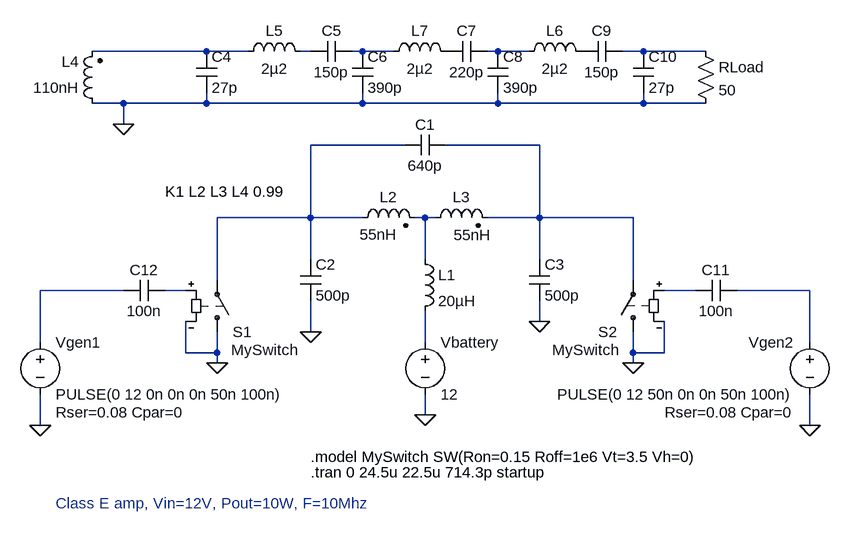
[diagram p0: schematic classe-pushpull-10Mhz-tuned-bpf.asc]
classe-pushpull-10Mhz-tuned-bpf.asc, the LTspice schematic file:
Version 4
SHEET 1 1364 344
WIRE 256 -368 80 -368
WIRE 320 -368 256 -368
WIRE 416 -368 400 -368
WIRE 496 -368 480 -368
WIRE 544 -368 496 -368
WIRE 704 -368 688 -368
WIRE 752 -368 704 -368
WIRE 928 -368 896 -368
WIRE 1024 -368 928 -368
WIRE 128 -288 80 -288
WIRE 256 -288 256 -304
WIRE 256 -288 128 -288
WIRE 496 -288 496 -304
WIRE 496 -288 256 -288
WIRE 704 -288 704 -304
WIRE 704 -288 496 -288
WIRE 928 -288 928 -304
WIRE 928 -288 704 -288
WIRE 1024 -288 928 -288
WIRE 128 -256 128 -288
WIRE 560 -224 416 -224
WIRE 768 -224 624 -224
WIRE 416 -112 416 -224
WIRE 416 -112 272 -112
WIRE 496 -112 416 -112
WIRE 592 -112 576 -112
WIRE 608 -112 592 -112
WIRE 768 -112 768 -224
WIRE 768 -112 688 -112
WIRE 912 -112 768 -112
WIRE 416 -48 416 -112
WIRE 592 -48 592 -112
WIRE 768 -48 768 -112
WIRE 272 -16 272 -112
WIRE 912 -16 912 -112
WIRE 128 0 0 0
WIRE 224 0 192 0
WIRE 1008 0 960 0
WIRE 1184 0 1072 0
WIRE 768 48 768 16
WIRE 416 64 416 16
WIRE 0 80 0 0
WIRE 592 80 592 32
WIRE 1184 80 1184 0
WIRE 224 96 224 48
WIRE 272 96 272 64
WIRE 272 96 224 96
WIRE 912 96 912 64
WIRE 960 96 960 48
WIRE 960 96 912 96
WIRE 272 112 272 96
WIRE 912 112 912 96
WIRE 592 192 592 160
WIRE 0 208 0 160
WIRE 1184 208 1184 160
FLAG 0 208 0
FLAG 272 112 0
FLAG 592 192 0
FLAG 416 64 0
FLAG 1184 208 0
FLAG 912 112 0
FLAG 768 48 0
FLAG 128 -256 0
SYMBOL voltage 592 64 R0
WINDOW 123 24 132 Left 2
WINDOW 39 0 0 Left 2
SYMATTR Value2 ""
SYMATTR SpiceLine ""
SYMATTR InstName Vbattery
SYMATTR Value 12
SYMBOL voltage 0 64 R0
WINDOW 123 24 132 Left 2
WINDOW 39 24 124 Left 2
SYMATTR Value2 ""
SYMATTR SpiceLine Rser=0.08 Cpar=0
SYMATTR InstName Vgen1
SYMATTR Value PULSE(0 12 0n 0n 0n 50n 100n)
SYMBOL ind 576 -64 R0
SYMATTR InstName L1
SYMATTR Value 20µH
SYMATTR SpiceLine Rser=0.5
SYMBOL cap 400 -48 R0
SYMATTR InstName C2
SYMATTR Value 500p
SYMATTR SpiceLine Rser=25m
SYMBOL cap 624 -240 R90
WINDOW 0 0 32 VBottom 2
WINDOW 3 32 32 VTop 2
SYMATTR InstName C1
SYMATTR Value 640p
SYMATTR SpiceLine Rser=0.015
SYMBOL ind2 480 -96 R270
WINDOW 0 32 56 VTop 2
WINDOW 3 6 40 VBottom 2
SYMATTR InstName L2
SYMATTR Value 55nH
SYMATTR Type ind
SYMATTR SpiceLine Rser=0.045
SYMBOL res 1008 -384 R0
SYMATTR InstName RLoad
SYMATTR Value 50
SYMBOL sw 272 80 M180
WINDOW 3 22 -12 Left 2
SYMATTR Value MySwitch
SYMATTR InstName S1
SYMBOL voltage 1184 64 M0
WINDOW 123 24 132 Left 2
WINDOW 39 24 124 Left 2
SYMATTR Value2 ""
SYMATTR SpiceLine Rser=0.08 Cpar=0
SYMATTR InstName Vgen2
SYMATTR Value PULSE(0 12 50n 0n 0n 50n 100n)
SYMBOL sw 912 80 R180
WINDOW 3 22 -12 Left 2
SYMATTR Value MySwitch
SYMATTR InstName S2
SYMBOL ind2 592 -96 R270
WINDOW 0 32 56 VTop 2
WINDOW 3 5 73 VBottom 2
SYMATTR InstName L3
SYMATTR Value 55nH
SYMATTR Type ind
SYMATTR SpiceLine Rser=0.045
SYMBOL cap 752 -48 R0
SYMATTR InstName C3
SYMATTR Value 500p
SYMATTR SpiceLine Rser=25m
SYMBOL ind2 96 -272 R180
WINDOW 0 36 80 Left 2
WINDOW 3 36 40 Left 2
SYMATTR InstName L4
SYMATTR Value 110nH
SYMATTR Type ind
SYMATTR SpiceLine Rser=0.05
SYMBOL cap 240 -368 R0
SYMATTR InstName C4
SYMATTR Value 27p
SYMATTR SpiceLine Rser=15m
SYMBOL ind 304 -352 R270
WINDOW 0 32 56 VTop 2
WINDOW 3 5 56 VBottom 2
SYMATTR InstName L5
SYMATTR Value 2µ2
SYMBOL cap 480 -384 R90
WINDOW 0 0 32 VBottom 2
WINDOW 3 32 32 VTop 2
SYMATTR InstName C5
SYMATTR Value 150p
SYMATTR SpiceLine Rser=15m
SYMBOL cap 480 -368 R0
SYMATTR InstName C6
SYMATTR Value 390p
SYMATTR SpiceLine Rser=15m
SYMBOL cap 688 -384 R90
WINDOW 0 0 32 VBottom 2
WINDOW 3 32 32 VTop 2
SYMATTR InstName C7
SYMATTR Value 220p
SYMATTR SpiceLine Rser=15m
SYMBOL cap 688 -368 R0
SYMATTR InstName C8
SYMATTR Value 390p
SYMATTR SpiceLine Rser=15m
SYMBOL cap 896 -384 R90
WINDOW 0 0 32 VBottom 2
WINDOW 3 32 32 VTop 2
SYMATTR InstName C9
SYMATTR Value 150p
SYMATTR SpiceLine Rser=15m
SYMBOL cap 912 -368 R0
SYMATTR InstName C10
SYMATTR Value 27p
SYMATTR SpiceLine Rser=15m
SYMBOL ind 736 -352 R270
WINDOW 0 32 56 VTop 2
WINDOW 3 5 56 VBottom 2
SYMATTR InstName L6
SYMATTR Value 2µ2
SYMBOL ind 528 -352 R270
WINDOW 0 32 56 VTop 2
WINDOW 3 5 56 VBottom 2
SYMATTR InstName L7
SYMATTR Value 2µ2
SYMBOL cap 1072 -16 R90
WINDOW 0 0 32 VBottom 2
WINDOW 3 32 32 VTop 2
SYMATTR InstName C11
SYMATTR Value 100n
SYMATTR SpiceLine Rser=25m
SYMBOL cap 192 -16 R90
WINDOW 0 0 32 VBottom 2
WINDOW 3 32 32 VTop 2
SYMATTR InstName C12
SYMATTR Value 100n
SYMATTR SpiceLine Rser=25m
TEXT 416 280 Left 2 !.tran 0 24.5u 22.5u 714.3p startup
TEXT 416 256 Left 2 !.model MySwitch SW(Ron=0.15 Roff=1e6 Vt=3.5 Vh=0)
TEXT 24 328 Left 2 ;Class E amp, Vin=12V, Pout=10W, F=10Mhz
TEXT 192 -152 Left 2 !K1 L2 L3 L4 0.99

The netlist it stands for:
* classe-pushpull-10Mhz-tuned-bpf.asc
Vbattery N013 0 12
Vgen1 N009 0 PULSE(0 12 0n 0n 0n 50n 100n) Rser=0.08 Cpar=0
L1 N008 N013 20µH Rser=0.5
C2 N006 0 500p Rser=25m
C1 N007 N006 640p Rser=0.015
L2 N006 N008 55nH Rser=0.045
RLoad N005 0 50
S1 0 N006 N010 0 MySwitch
Vgen2 N012 0 PULSE(0 12 50n 0n 0n 50n 100n) Rser=0.08 Cpar=0
S2 0 N007 N011 0 MySwitch
L3 N008 N007 55nH Rser=0.045
C3 N007 0 500p Rser=25m
L4 0 N001 110nH Rser=0.05
C4 N001 0 27p Rser=15m
L5 N001 N002 2µ2
C5 N003 N002 150p Rser=15m
C6 N003 0 390p Rser=15m
C7 N004 P001 220p Rser=15m
C8 N004 0 390p Rser=15m
C9 N005 P002 150p Rser=15m
C10 N005 0 27p Rser=15m
L6 N004 P002 2µ2
L7 N003 P001 2µ2
C11 N012 N011 100n Rser=25m
C12 N010 N009 100n Rser=25m
.tran 0 24.5u 22.5u 714.3p startup
.model MySwitch SW(Ron=0.15 Roff=1e6 Vt=3.5 Vh=0)
* Class E amp, Vin=12V, Pout=10W, F=10Mhz
K1 L2 L3 L4 0.99
.backanno
.end